# EAGLE design BI16_base (EAGLE 7.1.0)

## Sheet 1 of 2
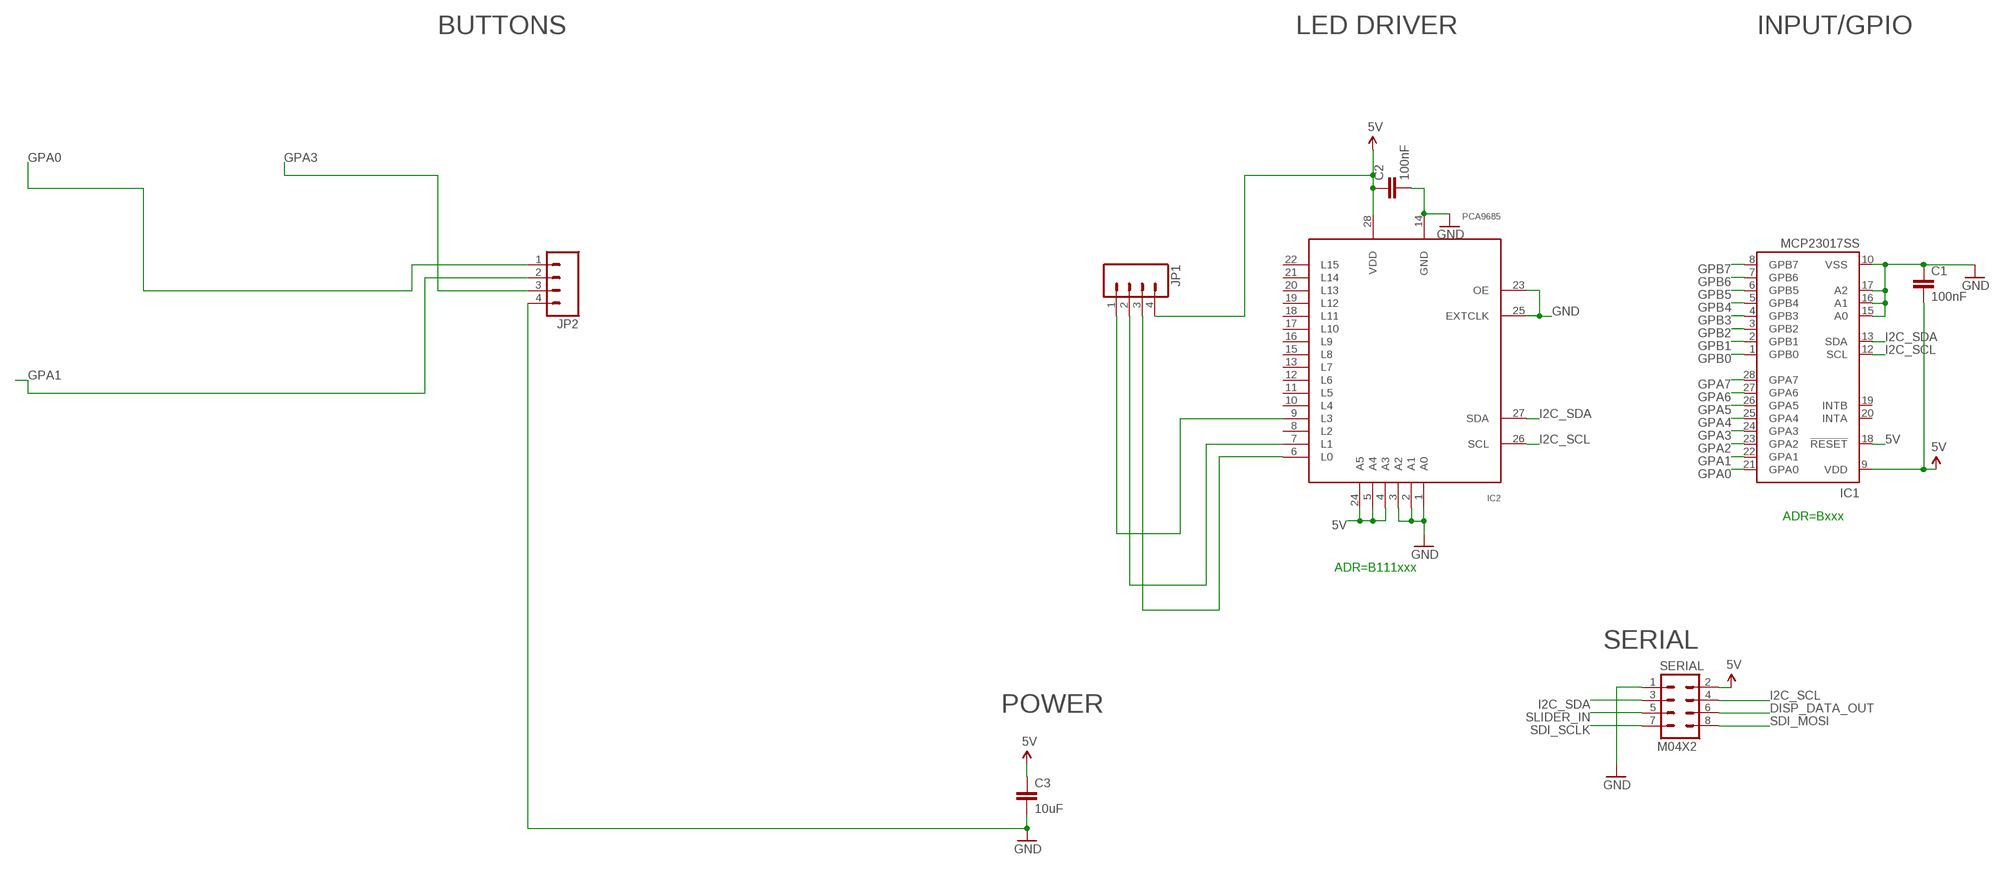
[diagram p0: schematic, sheet 1]

### Parts
C1  100nF  CAP0603-CAP  [0603-CAP]
C2  100nF  CAP0603-CAP  [0603-CAP]
C3  10uF  CAP0805  [0805]
IC1  MCP23017SS  [SSOP28]
IC2  PCA9685  [TSSOP28]
JP1  M04LOCK  [1X04_LOCK]
JP2  M04LOCK  [1X04_LOCK]
SERIAL  M04X2  [2X4]

### Nets
5V [Power]: C1.2 C2.1 C3.1 IC1.9(VDD) IC1.18(!RESET) IC2.4(A3) IC2.5(A4) IC2.24(A5) IC2.28(VDD) JP1.4 SERIAL.2
DISP_DATA_OUT: SERIAL.6
GND [Power]: C1.1 C2.2 C3.2 IC1.10(VSS) IC1.15(A0) IC1.16(A1) IC1.17(A2) IC2.1(A0) IC2.2(A1) IC2.3(A2) IC2.14(GND) IC2.23(OE) IC2.25(EXTCLK) JP2.4 SERIAL.1
GPA0: IC1.21(GPA0) JP2.1
GPA1: IC1.22(GPA1) JP2.2
GPA2: IC1.23(GPA2)
GPA3: IC1.24(GPA3) JP2.3
GPA4: IC1.25(GPA4)
GPA5: IC1.26(GPA5)
GPA6: IC1.27(GPA6)
GPA7: IC1.28(GPA7)
GPB0 [Power]: IC1.1(GPB0)
GPB1: IC1.2(GPB1)
GPB2: IC1.3(GPB2)
GPB3: IC1.4(GPB3)
GPB4: IC1.5(GPB4)
GPB5: IC1.6(GPB5)
GPB6: IC1.7(GPB6)
GPB7: IC1.8(GPB7)
I2C_SCL: IC1.12(SCL) IC2.26(SCL) SERIAL.4
I2C_SDA: IC1.13(SDA) IC2.27(SDA) SERIAL.3
N$10: IC2.9(L3) JP1.1
N$12: IC2.7(L1) JP1.2
N$19: IC2.6(L0) JP1.3
SDI_MOSI: SERIAL.8
SDI_SCLK: SERIAL.7
SLIDER_IN: SERIAL.5
Unconnected: IC1.19(INTB) IC1.20(INTA) IC2.8(L2) IC2.10(L4) IC2.11(L5) IC2.12(L6) IC2.13(L7) IC2.15(L8) IC2.16(L9) IC2.17(L10) IC2.18(L11) IC2.19(L12) IC2.20(L13) IC2.21(L14) IC2.22(L15)

### Notes on the sheet
- BUTTONS | LED DRIVER | INPUT/GPIO
- ADR=Bxxx
- ADR=B111xxx
- SERIAL
- POWER

## Sheet 2 of 2

## Library data of the parts
C1-C3 = SparkFun:CAP: Capacitor Standard 0603 ceramic capacitor, and 0.1" leaded capacitor.
IC1 = microchip:MCP23017: http://ww1.microchip.com/downloads/en/DeviceDoc/21952a.pdf Source: http://ww1.microchip.com/downloads/en/DeviceDoc/21952a.pdf; MF: MICROCHIP; MPN: MCP23017-E/SS; OC_FARNELL: 1467674; OC_NEWARK: 31K2960
IC2 = wsmith:PCA9685
JP1 JP2 = SparkFun:M04: Header 4 Standard 4-pin 0.1" header. Use with straight break away headers (SKU : PRT-00116), right angle break away headers (PRT-00553), swiss pins (PRT-00743), machine pins (PRT-00117), and female headers (PRT-00115). Molex polarized connector foot print use with SKU : PRT-08231 with associated crimp pins and housings. 1MM SMD Version SKU: PRT-10208
SERIAL = SparkFun:M04X2

## Net classes
0 default: width 0.203 mm, drill 0.305 mm, clearance 0.152 mm
1 Power: width 0.406 mm, drill 0.61 mm, clearance 0.203 mm

## Board
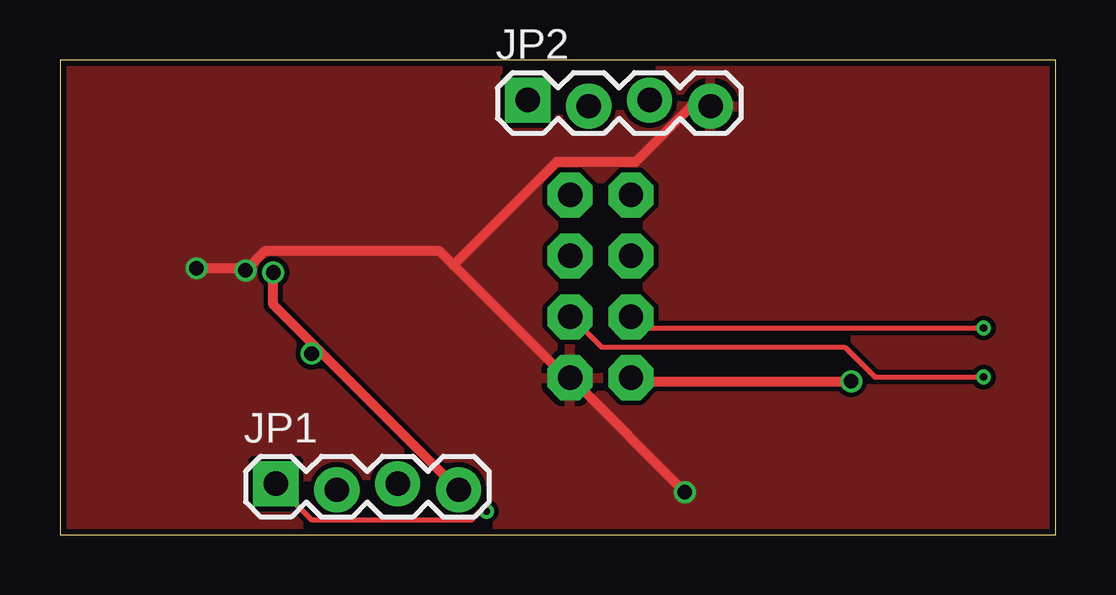
[diagram p1: board, top side]
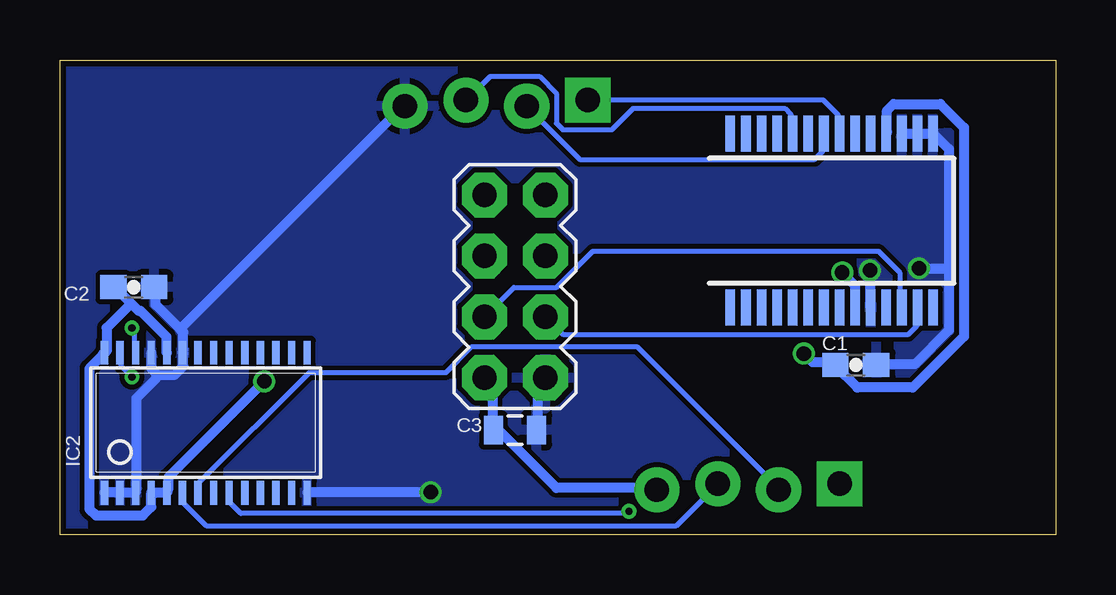
[diagram p2: board, bottom side, seen from below]

Size 41.5 x 19.8 mm. Coordinates in mm from the lower left corner, seen from the top.
Outline: 0,0 41.5,0 41.5,19.8 0,19.8 0,0
Copper layers (1*16): Top 0.035mm / dielectric 1.5mm / Bottom 0.035mm
Design rules "Fusion_eagle_rule_v1.1": minimum track width 6mil, minimum drill 12mil, track to track 6mil, track to pad 6mil, pad to pad 6mil, via to via 6mil, smd to smd 0mil, copper to edge 10mil, drill to drill 10mil, minimum pad ring 10mil, minimum via ring 6mil, stop-mask expansion 2mil, vias tented up to drill 100mil, thermal gap 10mil

### Footprints (pad centres in the part's own frame; a part is rotated, then mirrored left to right if it is on the bottom)
0603-CAP = smd 1.1 x 1: 1 -0.85,0; 2 0.85,0
0805 = smd 0.8 x 1.2: 1 -0.9,0; 2 0.9,0
SSOP28 = smd 0.4 x 1.5: 1 -4.225,-3.625; 2 -3.575,-3.625; 3 -2.925,-3.625; 4 -2.275,-3.625; 5 -1.625,-3.625; 6 -0.975,-3.625; 7 -0.325,-3.625; 8 0.325,-3.625; 9 0.975,-3.625; 10 1.625,-3.625; 11 2.275,-3.625; 12 2.925,-3.625; 13 3.575,-3.625; 14 4.225,-3.625; 15 4.225,3.625; 16 3.575,3.625; 17 2.925,3.625; 18 2.275,3.625; 19 1.625,3.625; 20 0.975,3.625; 21 0.325,3.625; 22 -0.325,3.625; 23 -0.975,3.625; 24 -1.625,3.625; 25 -2.275,3.625; 26 -2.925,3.625; 27 -3.575,3.625; 28 -4.225,3.625
TSSOP28 = smd 0.305 x 0.991: 1 -4.225,-2.918; 2 -3.575,-2.918; 3 -2.925,-2.918; 4 -2.275,-2.918; 5 -1.625,-2.918; 6 -0.975,-2.918; 7 -0.325,-2.918; 8 0.325,-2.918; 9 0.975,-2.918; 10 1.625,-2.918; 11 2.275,-2.918; 12 2.925,-2.918; 13 3.575,-2.918; 14 4.225,-2.918; 15 4.225,2.918; 16 3.575,2.918; 17 2.925,2.918; 18 2.275,2.918; 19 1.625,2.918; 20 0.975,2.918; 21 0.325,2.918; 22 -0.325,2.918; 23 -0.975,2.918; 24 -1.625,2.918; 25 -2.275,2.918; 26 -2.925,2.918; 27 -3.575,2.918; 28 -4.225,2.918
1X04_LOCK = drill 1.016 pad 1.88 square: 1 0,0.127 | drill 1.016 pad 1.88: 2 2.54,-0.127; 3 5.08,0.127; 4 7.62,-0.127
2X4 = drill 1.016 pad 1.88 octagon: 1 -3.81,-1.27; 2 -3.81,1.27; 3 -1.27,-1.27; 4 -1.27,1.27; 5 1.27,-1.27; 6 1.27,1.27; 7 3.81,-1.27; 8 3.81,1.27

### Placement (x,y rotation side)
C1  8.33,7.08 180 bottom
C2  38.42,10.32 0 bottom
C3  22.53,4.36 0 bottom
IC1  9.33,13.1 0 bottom
IC2  35.42,4.67 0 bottom
JP1  9,2 0 top
JP2  19.5,18 0 top
SERIAL  22.53,10.36 90 bottom

### Tracks (layer width: path | path; a pad name or v marks a point on that pad's centre or on a via)
5V  (via drill 0.61)
  Top 0.406: v8.89,10.94 8.89,9.6 10.71,7.78 | 10.71,7.78 16.54,1.96 JP1.4 | v32.98,6.4 23.91,6.4 23.82,6.49 SERIAL.2 | v10.49,7.56 10.71,7.78
  Bottom 0.406: IC1.18 7.02,16.8 7.02,17.69 6.76,17.96 4.8,17.96 3.82,16.98 3.82,8.27 5.96,6.13 8.27,6.13 9.16,7.02 C1.2 9.34,7.2 10.13,7.2 v10.49,7.56 | 38.54,9.65 39.2,10.31 C2.1 | 38.54,9.65 38.23,9.34 38.14,9.34 37.07,8.27 37.07,7.64 IC2.24 | 38.54,9.65 39.56,8.62 39.56,7.64 IC2.28 39.74,7.47 40.27,6.93 40.27,1.07 40.01,0.8 38.05,0.8 37.69,1.16 37.69,1.6 IC2.4 37.69,1.78 37.07,1.78 IC2.5 36.98,1.96 36.98,2.4 v32.98,6.4 | SERIAL.2 23.74,6.49 23.47,6.22 23.47,4.45 C3.1 23.29,4.27 23.11,4.27 20.8,1.96 16.62,1.96 JP1.4 | v8.89,10.94 8.36,10.4 8.36,9.51 IC1.9
GND  (via drill 0.61)
  Top 0.406: v26.05,1.78 21.34,6.49 SERIAL.1 21.07,6.58 16.4,11.25 | 16.4,11.25 15.82,11.82 8.53,11.82 v7.73,11.02 7.56,11.11 v5.69,11.11 | 16.4,11.25 20.71,15.56 24,15.56 26.31,17.87 JP2.4
  Bottom 0.406: IC2.1 39.56,1.78 39.2,1.78 IC2.2 38.94,1.78 38.41,1.78 IC2.3 38.32,1.96 38.32,5.69 37.52,6.49 37.43,6.67 | 37.43,6.67 36.72,6.67 36.36,7.02 36.36,7.56 IC2.23 36.36,7.73 36.36,8.45 36.49,8.58 | 37.43,6.67 37.69,6.93 37.69,7.56 IC2.25 | 36.49,8.58 37.52,9.6 37.52,10.31 C2.2 | 36.49,8.58 27.2,17.87 JP2.4 | 4.45,11.11 4.45,16.09 5.07,16.71 IC1.15 5.25,16.71 5.69,16.71 IC1.16 5.96,16.71 IC1.17 | 4.45,11.11 4.45,8.53 5.87,7.11 7.47,7.11 C1.1 | v26.05,1.78 31.11,1.78 IC2.14 | C3.2 21.6,4.45 21.6,6.22 21.34,6.49 SERIAL.1 | v7.73,11.02 7.73,9.51 IC1.10 | v5.69,11.11 4.45,11.11
  pour Top: 0,0 41.5,0 41.5,20 0,20
  pour Bottom: 0,0 41.5,0 41.5,20 0,20
GPA0
  Bottom 0.203: IC1.21 9.07,16.8 9.07,17.51 9.69,18.14 19.47,18.14 JP2.1
GPA1
  Bottom 0.203: IC1.22 9.69,16.71 9.69,16 10.05,15.65 19.82,15.65 JP2.2
GPA3
  Bottom 0.203: IC1.24 11.02,16.8 11.02,17.51 11.29,17.78 17.6,17.78 18.49,16.89 20.54,16.89 20.8,17.16 20.8,18.4 21.51,19.11 23.56,19.11 24.54,18.14 JP2.3
I2C_SCL  (via drill 0.3)
  Top 0.203: v38.49,8.62 24.27,8.62 23.82,9.07 SERIAL.4
  Bottom 0.203: v38.49,8.62 38.41,8.53 38.41,7.64 IC2.26 | IC1.12 6.49,9.51 6.49,10.94 7.38,11.82 19.29,11.82 20.8,10.31 22.58,10.31 23.74,9.16 SERIAL.4
I2C_SDA  (via drill 0.3)
  Top 0.203: v38.49,6.58 33.96,6.58 32.72,7.82 22.58,7.82 21.34,9.07 SERIAL.3
  Bottom 0.203: v38.49,6.58 38.94,7.02 38.94,7.56 IC2.27 | IC1.13 5.78,9.42 5.78,8.71 6.13,8.36 20.54,8.36 21.25,9.07 SERIAL.3
N$10  (via drill 0.3)
  Top 0.203: v17.78,0.98 17.51,0.98 17.16,0.62 10.49,0.62 9.07,2.04 JP1.1
  Bottom 0.203: v17.78,0.98 17.87,0.89 33.96,0.89 34.4,1.33 34.4,1.69 IC2.9
N$12
  Bottom 0.203: IC2.7 35.74,1.78 35.74,2.13 31.11,6.76 25.43,6.76 24.36,7.82 17.42,7.82 11.56,1.96 JP1.2
N$19
  Bottom 0.203: IC2.6 36.36,1.69 36.36,1.33 35.38,0.36 15.82,0.36 14.13,2.04 JP1.3